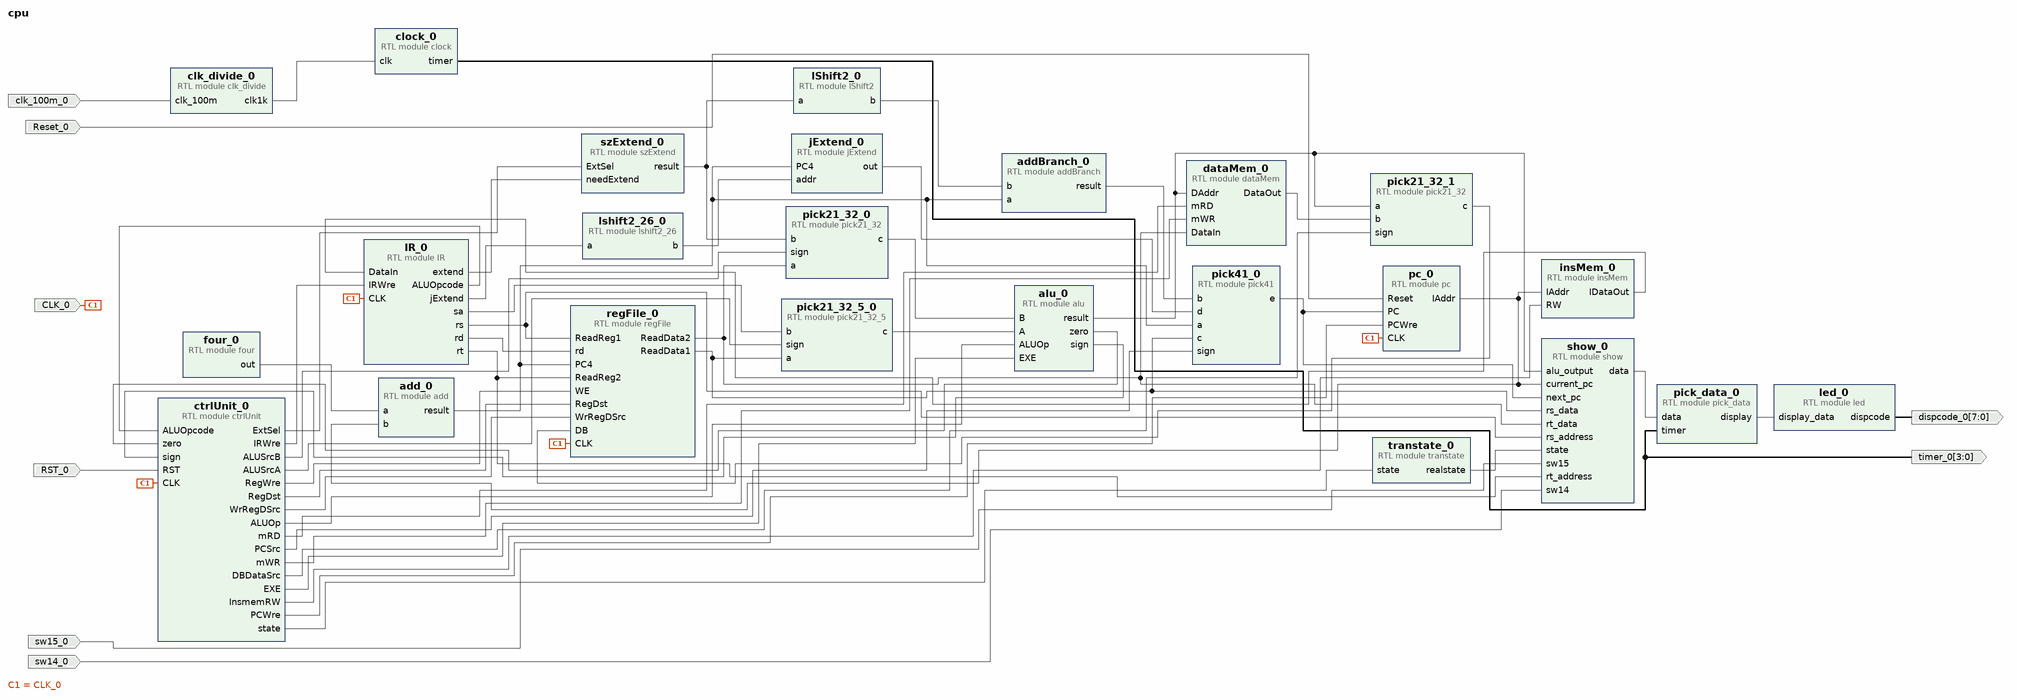
[diagram p0: block diagram of the top level]
# Vivado block design cpu, xc7a35tcpg236-1, Vivado 2018.1
create_bd_design cpu

create_bd_port -dir I -type clk CLK_0
create_bd_port -dir I -type rst Reset_0
create_bd_port -dir O -from 3 -to 0 timer_0
create_bd_port -dir O -from 7 -to 0 dispcode_0
create_bd_port -dir I sw15_0
create_bd_port -dir I sw14_0
create_bd_port -dir I clk_100m_0
create_bd_port -dir I -type rst RST_0

create_bd_cell -type module -reference four four_0
create_bd_cell -type module -reference lshift2_26 lshift2_26_0
create_bd_cell -type module -reference szExtend szExtend_0
create_bd_cell -type module -reference add add_0
create_bd_cell -type module -reference addBranch addBranch_0
create_bd_cell -type module -reference lShift2 lShift2_0
create_bd_cell -type module -reference pick21_32_5 pick21_32_5_0
create_bd_cell -type module -reference pick21_32 pick21_32_0
create_bd_cell -type module -reference pick21_32 pick21_32_1
create_bd_cell -type module -reference pick_data pick_data_0
create_bd_cell -type module -reference led led_0
create_bd_cell -type module -reference clk_divide clk_divide_0
create_bd_cell -type module -reference clock clock_0
create_bd_cell -type module -reference pick41 pick41_0
create_bd_cell -type module -reference alu alu_0
create_bd_cell -type module -reference IR IR_0
create_bd_cell -type module -reference regFile regFile_0
create_bd_cell -type module -reference insMem insMem_0
create_bd_cell -type module -reference pc pc_0
create_bd_cell -type module -reference jExtend jExtend_0
create_bd_cell -type module -reference ctrlUnit ctrlUnit_0
create_bd_cell -type module -reference transtate transtate_0
create_bd_cell -type module -reference dataMem dataMem_0
create_bd_cell -type module -reference show show_0

# ---- connections ----

connect_bd_net -net CLK_0_1 [get_bd_ports CLK_0] \
  [get_bd_pins IR_0/CLK] [get_bd_pins regFile_0/CLK] [get_bd_pins pc_0/CLK] [get_bd_pins ctrlUnit_0/CLK]
connect_bd_net -net Reset_0_1 [get_bd_ports Reset_0] [get_bd_pins pc_0/Reset]
connect_bd_net [get_bd_pins four_0/out] [get_bd_pins add_0/a]
connect_bd_net [get_bd_pins pc_0/IAddr] [get_bd_pins add_0/b] [get_bd_pins insMem_0/IAddr] [get_bd_pins show_0/current_pc]
connect_bd_net [get_bd_pins clock_0/timer] [get_bd_ports timer_0] [get_bd_pins pick_data_0/timer]
connect_bd_net [get_bd_pins show_0/data] [get_bd_pins pick_data_0/data]
connect_bd_net [get_bd_pins pick_data_0/display] [get_bd_pins led_0/display_data]
connect_bd_net [get_bd_pins led_0/dispcode] [get_bd_ports dispcode_0]
connect_bd_net [get_bd_pins pick41_0/e] [get_bd_pins pc_0/PC] [get_bd_pins show_0/next_pc]
connect_bd_net -net xlslice_3_Dout [get_bd_pins IR_0/rs] [get_bd_pins regFile_0/ReadReg1] [get_bd_pins show_0/rs_address]
connect_bd_net [get_bd_pins regFile_0/ReadData1] [get_bd_pins pick41_0/c] [get_bd_pins pick21_32_5_0/a] [get_bd_pins show_0/rs_data]
connect_bd_net [get_bd_pins regFile_0/ReadData2] [get_bd_pins pick21_32_0/a] [get_bd_pins dataMem_0/DataIn] [get_bd_pins show_0/rt_data]
connect_bd_net [get_bd_pins ctrlUnit_0/ALUSrcA] [get_bd_pins pick21_32_5_0/sign]
connect_bd_net [get_bd_pins ctrlUnit_0/ALUSrcB] [get_bd_pins pick21_32_0/sign]
connect_bd_net [get_bd_pins pick21_32_5_0/c] [get_bd_pins alu_0/A]
connect_bd_net [get_bd_pins pick21_32_0/c] [get_bd_pins alu_0/B]
connect_bd_net [get_bd_pins szExtend_0/result] [get_bd_pins pick21_32_0/b] [get_bd_pins lShift2_0/a]
connect_bd_net [get_bd_pins ctrlUnit_0/ExtSel] [get_bd_pins szExtend_0/ExtSel]
connect_bd_net [get_bd_pins add_0/result] [get_bd_pins addBranch_0/a] [get_bd_pins pick41_0/a] [get_bd_pins regFile_0/PC4] [get_bd_pins jExtend_0/PC4]
connect_bd_net [get_bd_pins lshift2_26_0/b] [get_bd_pins jExtend_0/addr]
connect_bd_net [get_bd_pins jExtend_0/out] [get_bd_pins pick41_0/d]
connect_bd_net [get_bd_pins addBranch_0/result] [get_bd_pins pick41_0/b]
connect_bd_net [get_bd_pins lShift2_0/b] [get_bd_pins addBranch_0/b]
connect_bd_net [get_bd_pins alu_0/zero] [get_bd_pins ctrlUnit_0/zero]
connect_bd_net [get_bd_pins ctrlUnit_0/PCSrc] [get_bd_pins pick41_0/sign]
connect_bd_net [get_bd_pins ctrlUnit_0/ALUOp] [get_bd_pins alu_0/ALUOp]
connect_bd_net [get_bd_pins ctrlUnit_0/mRD] [get_bd_pins dataMem_0/mRD]
connect_bd_net [get_bd_pins ctrlUnit_0/mWR] [get_bd_pins dataMem_0/mWR]
connect_bd_net [get_bd_pins alu_0/result] [get_bd_pins pick21_32_1/a] [get_bd_pins dataMem_0/DAddr] [get_bd_pins show_0/alu_output]
connect_bd_net [get_bd_pins dataMem_0/DataOut] [get_bd_pins pick21_32_1/b]
connect_bd_net [get_bd_pins ctrlUnit_0/DBDataSrc] [get_bd_pins pick21_32_1/sign]
connect_bd_net [get_bd_pins ctrlUnit_0/RegWre] [get_bd_pins regFile_0/WE]
connect_bd_net [get_bd_pins ctrlUnit_0/InsmemRW] [get_bd_pins insMem_0/RW]
connect_bd_net -net sw15_0_1 [get_bd_ports sw15_0] [get_bd_pins show_0/sw15]
connect_bd_net -net sw14_0_1 [get_bd_ports sw14_0] [get_bd_pins show_0/sw14]
connect_bd_net [get_bd_pins clk_divide_0/clk1k] [get_bd_pins clock_0/clk]
connect_bd_net -net clk_100m_0_1 [get_bd_ports clk_100m_0] [get_bd_pins clk_divide_0/clk_100m]
connect_bd_net [get_bd_pins ctrlUnit_0/PCWre] [get_bd_pins pc_0/PCWre]
connect_bd_net [get_bd_pins ctrlUnit_0/IRWre] [get_bd_pins IR_0/IRWre]
connect_bd_net [get_bd_pins insMem_0/IDataOut] [get_bd_pins IR_0/DataIn]
connect_bd_net [get_bd_pins IR_0/ALUOpcode] [get_bd_pins ctrlUnit_0/ALUOpcode]
connect_bd_net [get_bd_pins alu_0/sign] [get_bd_pins ctrlUnit_0/sign]
connect_bd_net [get_bd_pins ctrlUnit_0/RegDst] [get_bd_pins regFile_0/RegDst]
connect_bd_net [get_bd_pins ctrlUnit_0/WrRegDSrc] [get_bd_pins regFile_0/WrRegDSrc]
connect_bd_net [get_bd_pins IR_0/jExtend] [get_bd_pins lshift2_26_0/a]
connect_bd_net [get_bd_pins IR_0/extend] [get_bd_pins szExtend_0/needExtend]
connect_bd_net [get_bd_pins IR_0/rt] [get_bd_pins regFile_0/ReadReg2] [get_bd_pins show_0/rt_address]
connect_bd_net [get_bd_pins IR_0/sa] [get_bd_pins pick21_32_5_0/b]
connect_bd_net -net RST_0_1 [get_bd_ports RST_0] [get_bd_pins ctrlUnit_0/RST]
connect_bd_net [get_bd_pins ctrlUnit_0/EXE] [get_bd_pins alu_0/EXE]
connect_bd_net [get_bd_pins pick21_32_1/c] [get_bd_pins regFile_0/DB]
connect_bd_net [get_bd_pins IR_0/rd] [get_bd_pins regFile_0/rd]
connect_bd_net [get_bd_pins transtate_0/realstate] [get_bd_pins show_0/state]
connect_bd_net [get_bd_pins ctrlUnit_0/state] [get_bd_pins transtate_0/state]

validate_bd_design
save_bd_design
